# Altium schematic sheet motors.SchDoc
size A3
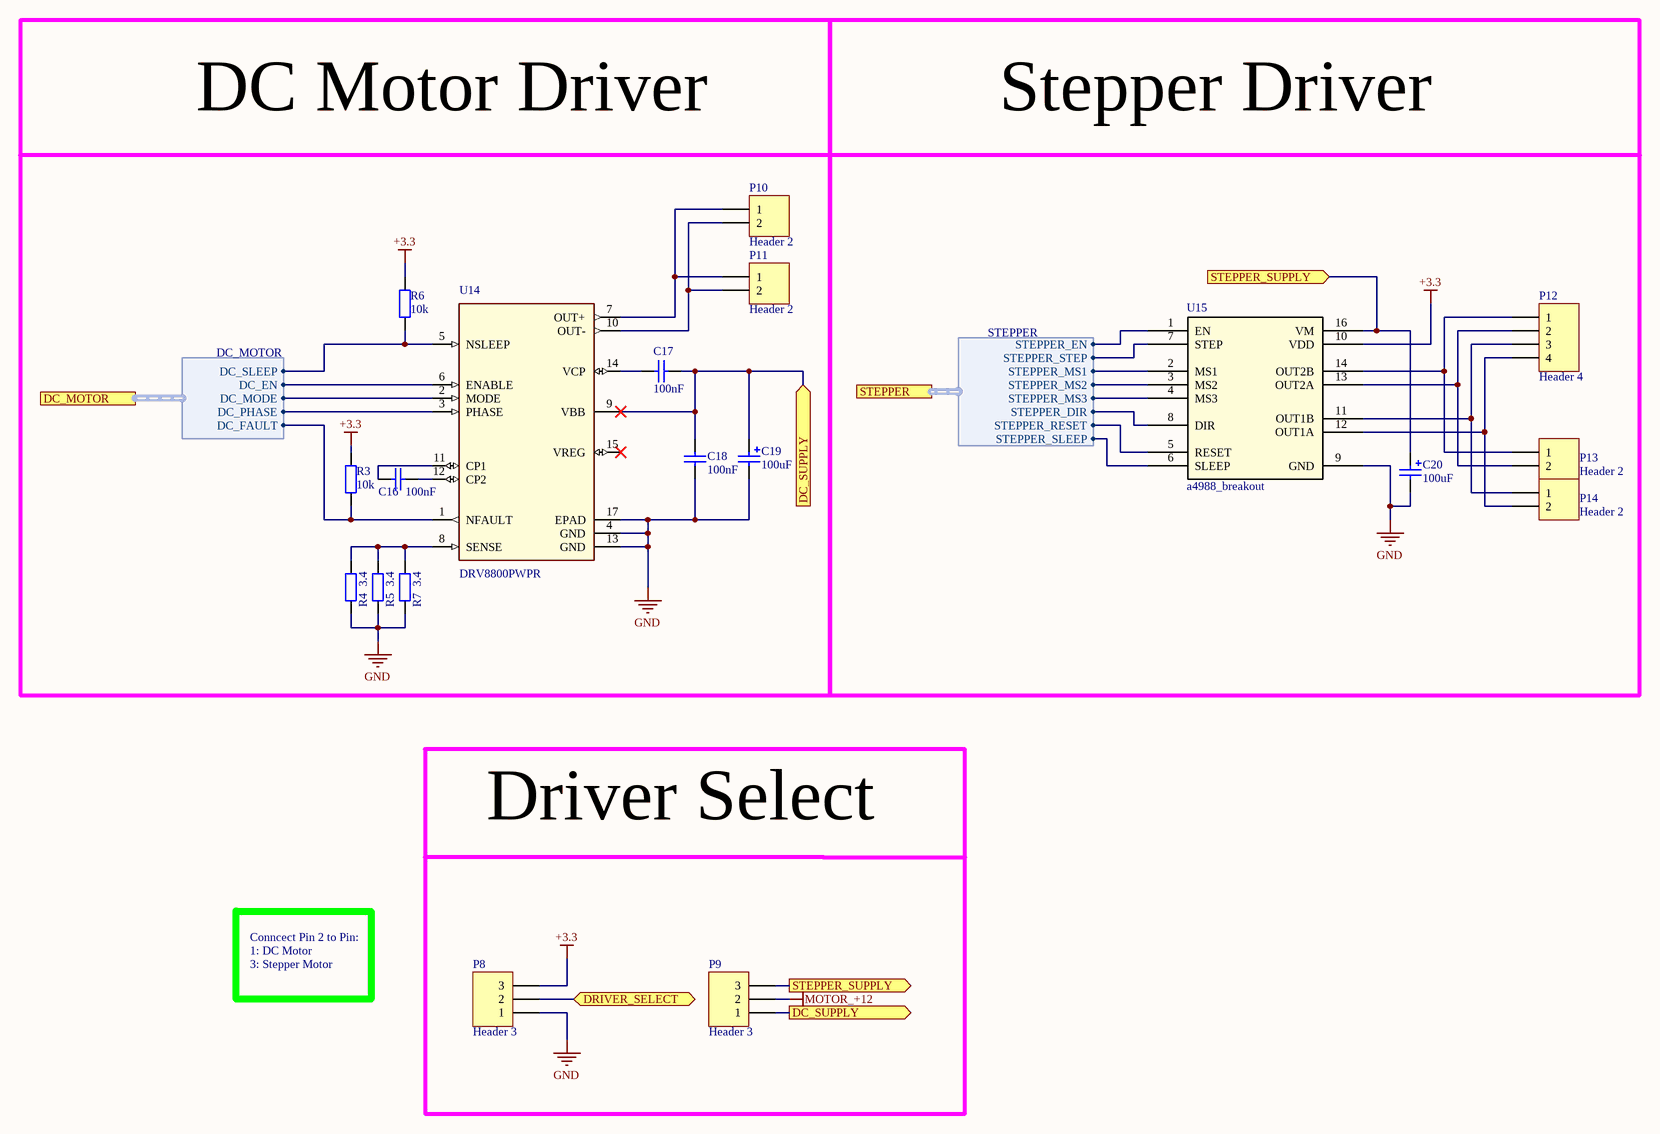
[diagram p0: motors.SchDoc]

## Parts
C16  100nF  [CAP_0603i_1608m -N]
C17  100nF  [CAP_0603i_1608m -N]
C18  100nF  [CAP_0603i_1608m -N]
C19  100uF  [Cap_F-Type-Package]
C20  100uF  [Cap_F-Type-Package]
P8  Header 3  [HDR1X3]
P9  Header 3  [HDR1X3]
P10  Header 2  [HDR1X2]
P11  Header 2  [3.5MM Phoenix Contact 1984617]
P12  Header 4  [HDR1X4]
P13  Header 2  [3.5MM Phoenix Contact 1984617]
P14  Header 2  [3.5MM Phoenix Contact 1984617]
R3  10k  [RES_0603i_1608m -N]
R4  3.4  [RES_1206i_C3216m -N]
R5  3.4  [RES_1206i_C3216m -N]
R6  10k  [RES_0603i_1608m -N]
R7  3.4  [RES_1206i_C3216m -N]
U14  DRV8800PWPR  [*SOP65P640X120-17N]
U15  a4988_breakout  [a4988_breakout]

## Ports
DC_MOTOR (harness DC_MOTOR), DC_SUPPLY (in), DC_SUPPLY (out), DRIVER_SELECT (bidir), STEPPER (harness STEPPER), STEPPER_SUPPLY (in), STEPPER_SUPPLY (out)

## Harnesses
DC_MOTOR: DC_SLEEP, DC_EN, DC_MODE, DC_PHASE, DC_FAULT
STEPPER: STEPPER_EN, STEPPER_STEP, STEPPER_MS1, STEPPER_MS2, STEPPER_MS3, STEPPER_DIR, STEPPER_RESET, STEPPER_SLEEP

## Nets
+3.3: P8.3 R3.2 R6.2 U15.10(VDD)
GND: C18.1 C19.2 C20.2 P8.1 R4.1 R5.1 R7.1 U14.4(GND) U14.13(GND) U14.17(EPAD) U15.9(GND)
MOTOR_+12: P9.2
DC_SUPPLY: C17.1 C18.2 C19.1 P9.1 U14.9(VBB) ; port DC_SUPPLY
DRIVER_SELECT: P8.2 ; port DRIVER_SELECT
STEPPER_SUPPLY: C20.1 P9.3 U15.16(VM) ; port STEPPER_SUPPLY
NetC16_1: C16.1 U14.11(CP1)
NetC16_2: C16.2 U14.12(CP2)
NetC17_2: C17.2 U14.14(VCP)
NetP10_1: P10.1 P11.1 U14.7(OUT+)
NetP10_2: P10.2 P11.2 U14.10(OUT-)
NetP12_1: P12.1 P13.1 U15.14(OUT2B)
NetP12_2: P12.2 P13.2 U15.13(OUT2A)
NetP12_3: P12.3 P14.1 U15.11(OUT1B)
NetP12_4: P12.4 P14.2 U15.12(OUT1A)
NetR3_1: R3.1 U14.1(NFAULT) ; port DC_MOTOR.DC_FAULT
NetR4_2: R4.2 R5.2 R7.2 U14.8(SENSE)
NetR6_1: R6.1 U14.5(NSLEEP) ; port DC_MOTOR.DC_SLEEP
NetU14_2: U14.2(MODE) ; port DC_MOTOR.DC_MODE
NetU14_3: U14.3(PHASE) ; port DC_MOTOR.DC_PHASE
NetU14_6: U14.6(ENABLE) ; port DC_MOTOR.DC_EN
NetU15_1: U15.1(EN) ; port STEPPER.STEPPER_EN
NetU15_2: U15.2(MS1) ; port STEPPER.STEPPER_MS1
NetU15_3: U15.3(MS2) ; port STEPPER.STEPPER_MS2
NetU15_4: U15.4(MS3) ; port STEPPER.STEPPER_MS3
NetU15_5: U15.5(RESET) ; port STEPPER.STEPPER_RESET
NetU15_6: U15.6(SLEEP) ; port STEPPER.STEPPER_SLEEP
NetU15_7: U15.7(STEP) ; port STEPPER.STEPPER_STEP
NetU15_8: U15.8(DIR) ; port STEPPER.STEPPER_DIR

Not connected (* = marked no-connect by the designer): U14 15(VREG)*

## Notes on the sheet
- DC Motor Driver
- Stepper Driver
- Driver Select
- Conncect Pin 2 to Pin:
- 1: DC Motor
- 3: Stepper Motor
- 1
- 2
- 3
- 4
- 5
- 6
- 7
- 8
- A
- B
- C
- D
- Project:
- Date:
- Drawing number:
- Rev:
- Format:
- A3
- Drawn by:
- Laboratory:
- Page
- Sheet:
- of
- File:

## Library data of the parts
C16-C18 = Cap: capacitor
C19 C20 = Cap pol: Polarised capacitor (e.g. Electrolytic )
P8 P9 = Header 3: Header, 3-Pin
P10 P11 P13 P14 = Header 2: Header, 2-Pin
P12 = Header 4: Header, 4-Pin
R3-R7 = Res: Resistor
U14 = DRV8800PWPR: SnapEDA_Link: https://www.snapeda.com/parts/DRV8800PWPR/Texas%20Instruments/view-part/230050/?ref=snap; Value: *